# EAGLE design trial 3 (1) (EAGLE 6.5.0)
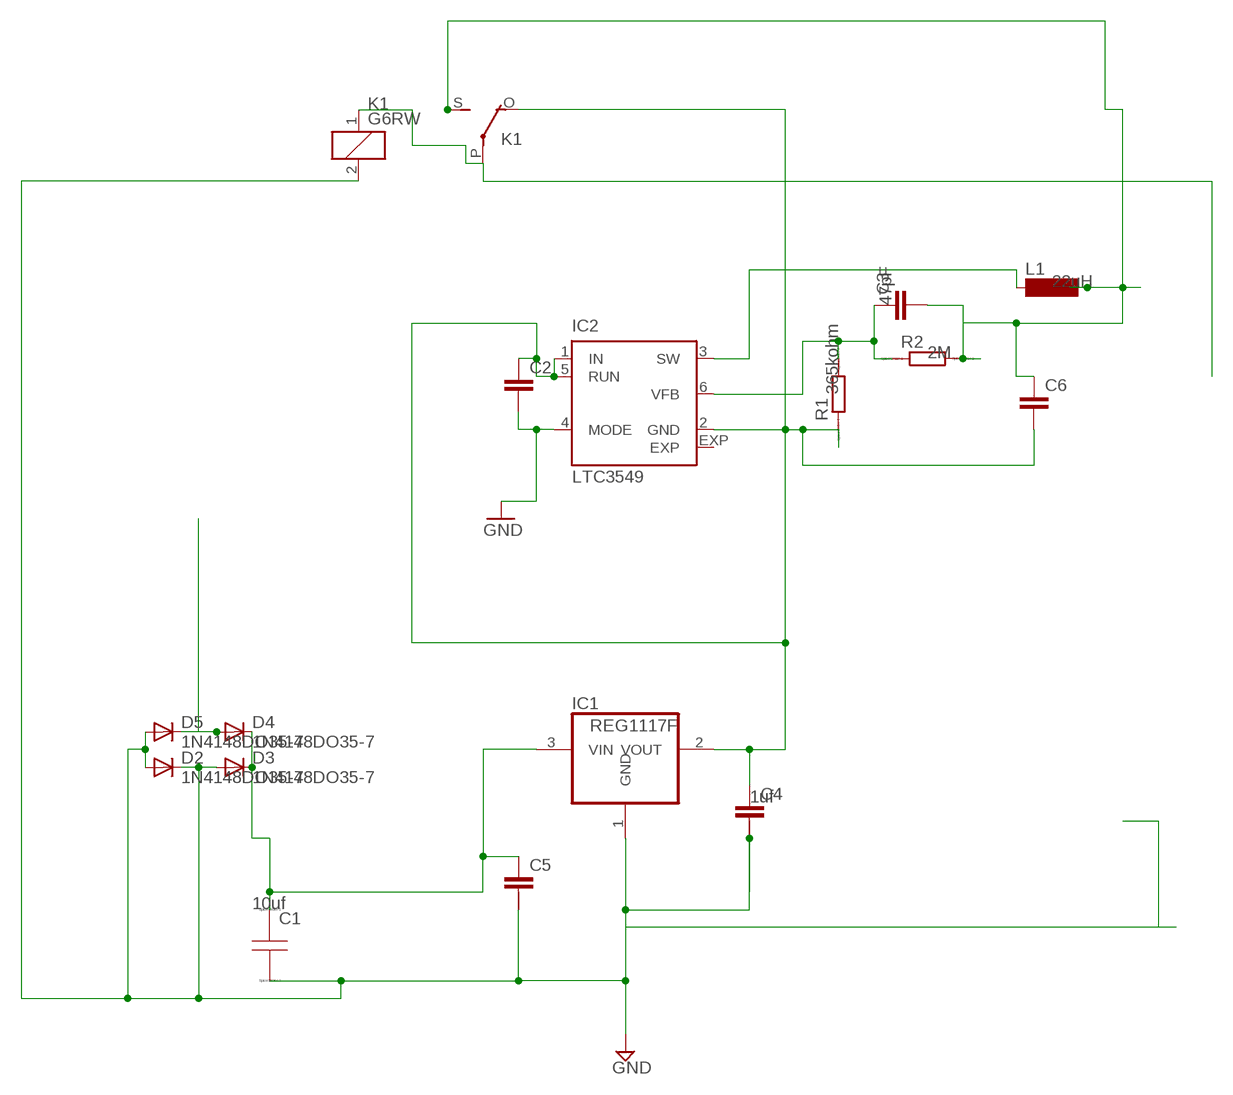
[diagram p0: schematic, sheet 1]

## Parts
C1  CAP  [C0805]
C2  C2,5-3  [C2.5-3]
C3  C2.5/4  [C2.5-4]
C4  C-2.5-5/5  [C2.5/5-5]
C5  C-2.5-5/5  [C2.5/5-5]
C6  C2.5/4  [C2.5-4]
D2  1N4148DO35-7  [DO35-7]
D3  1N4148DO35-7  [DO35-7]
D4  1N4148DO35-7  [DO35-7]
D5  1N4148DO35-7  [DO35-7]
IC1  REG1117F  [DD-3]
IC2  LTC3549  [DFN6-2X3]
K1  G6RW  [G6RW]
L1  MS85  [MS85]
R1  R0207/10  [0207/10]
R2  R0207/10  [0207/10]

## Nets
GND: C1.2(B) C2.2 C4.2 C5.2 D2.A D2.C D3.A D5.A IC1.1(GND) IC2.4(MODE) K1.2
N$1: C1.1(A) C5.1 D3.C D4.C IC1.3(VIN)
N$2: C2.1 C4.1 C6.2 IC1.2(VOUT) IC2.1(IN) IC2.2(GND) IC2.5(RUN) K1.O(2:O)
N$3: K1.1
N$5: C3.2 C6.1 K1.S(2:S) L1.2 R2.2
N$7: D4.A D5.C
N$8: C3.1 IC2.6(VFB) R1.2 R2.1
N$13: IC2.3(SW) L1.1
Unconnected: C4.3 C5.3 IC2.EXP K1.P(2:P) R1.1

## Library data of the parts
C1 = sym:CAP: Capacitor; C1: 10uf
C2 = capacitor-wima:C: CAPACITOR naming: grid - package width; C2: 1uf
C3 = capacitor-wima:C: CAPACITOR naming: grid - package width; C3: 47pF
C4 = capacitor-wima:C-: CAPACITOR for alternative placement naming: default grid - extended grid/package width; C4: 1uf
C5 = capacitor-wima:C-: CAPACITOR for alternative placement naming: default grid - extended grid/package width; C5: 1uf
C6 = capacitor-wima:C: CAPACITOR naming: grid - package width; C6: 4.7uF
D2-D5 = diode:1N4148: DIODE high speed (Philips)
IC1 = burr-brown:REG1117: 800mA and 1A Low Dropout (LDO) Positive Regulator 1.8V, 2.5V, 2.85V, 3.3V, 5V, and Adj; MF: TEXAS INSTRUMENTS; MPN: REG1117FAKTTT; OC_FARNELL: 1296120; OC_NEWARK: 87H2562
IC2 = linear-technology:LTC3549: 250mA Low VIN Buck Source: http://www.linear.com/pc/downloadDocument.do?navId=H0,C1,C1003,C1042,C1032,C1063,P26952,D16357; MPN: LTC3549EDCB#TRMPBF; OC_FARNELL: 1715241; OC_NEWARK: 56M8010
K1 = relay:G6RW: RELAY 1 x switch, Omron; OC_FARNELL: unknown; OC_NEWARK: unknown
L1 = inductor-neosid:MS85: INDUCTOR SMD power inductor; MF: 22uH; OC_FARNELL: unknown; OC_NEWARK: unknown
R1 = eagle-ltspice:R: RESISTOR, European symbol; SPICEMODEL: 365kohm; SPICEPREFIX: R
R2 = eagle-ltspice:R: RESISTOR, European symbol; SPICEMODEL: 2M; SPICEPREFIX: R

## Net classes
0 default: width 0.178 mm, drill 0.203 mm, clearance 0.025 mm

## Board
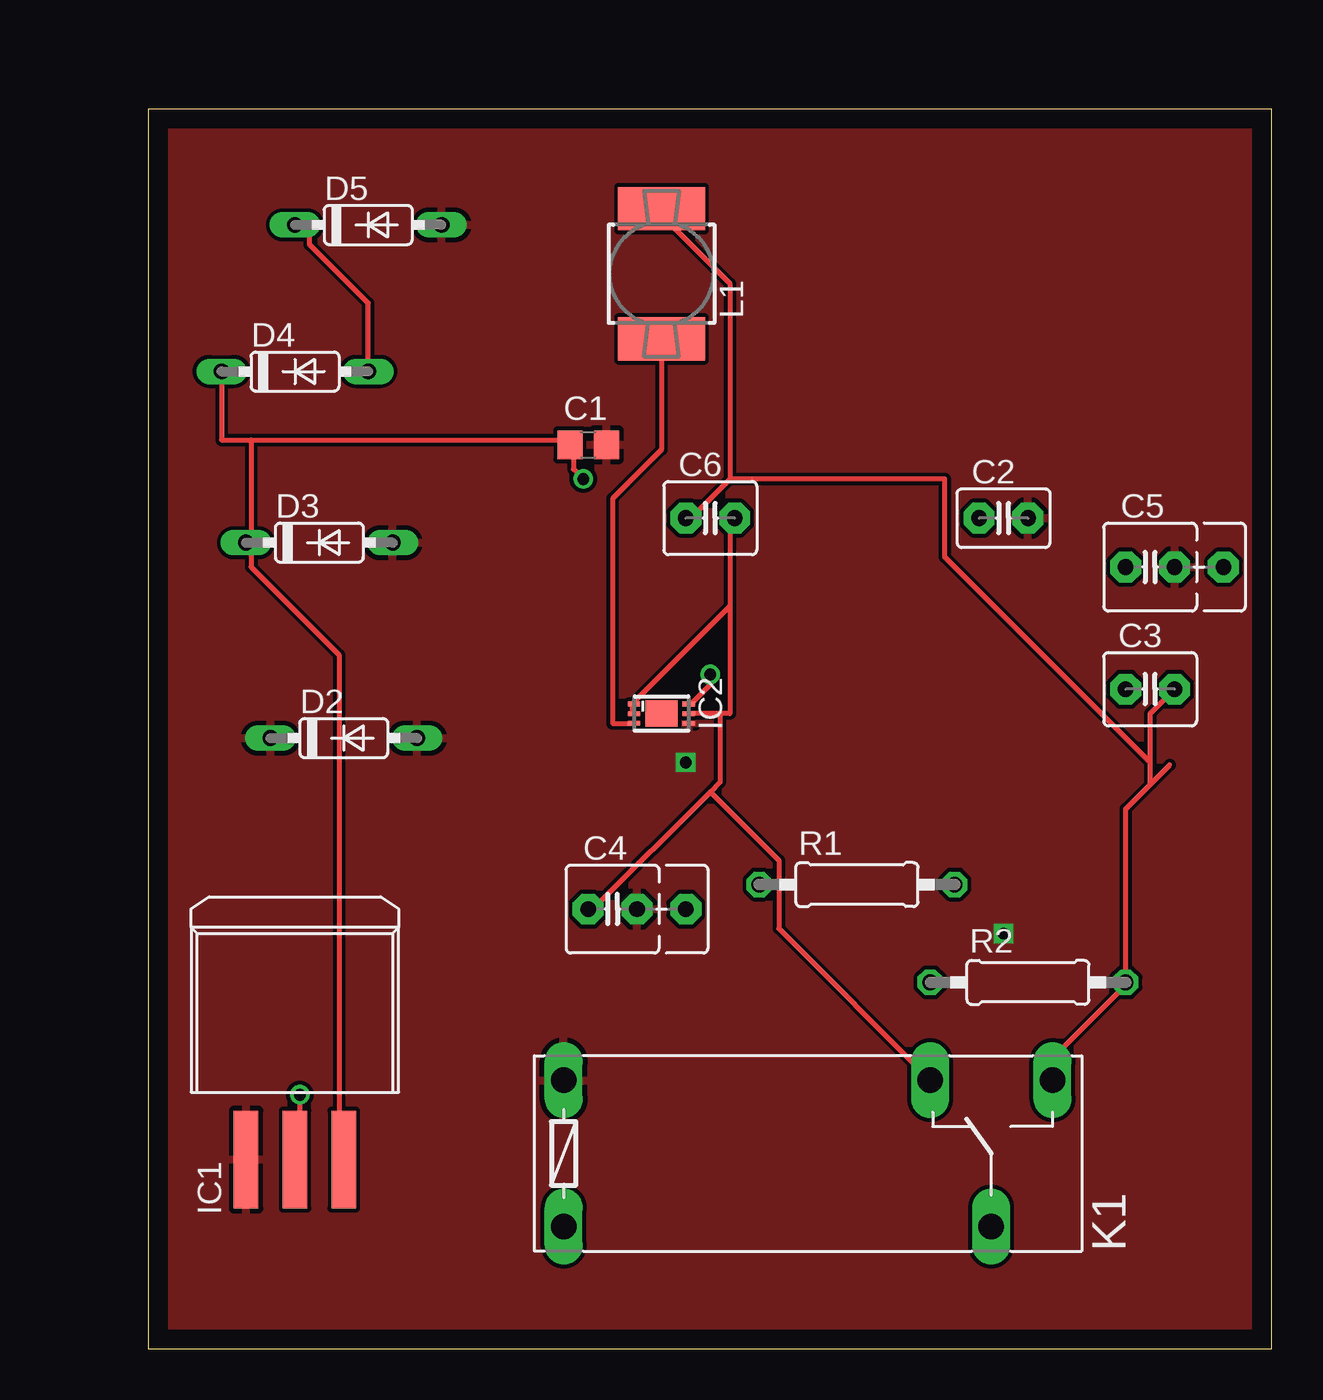
[diagram p1: board, top side]
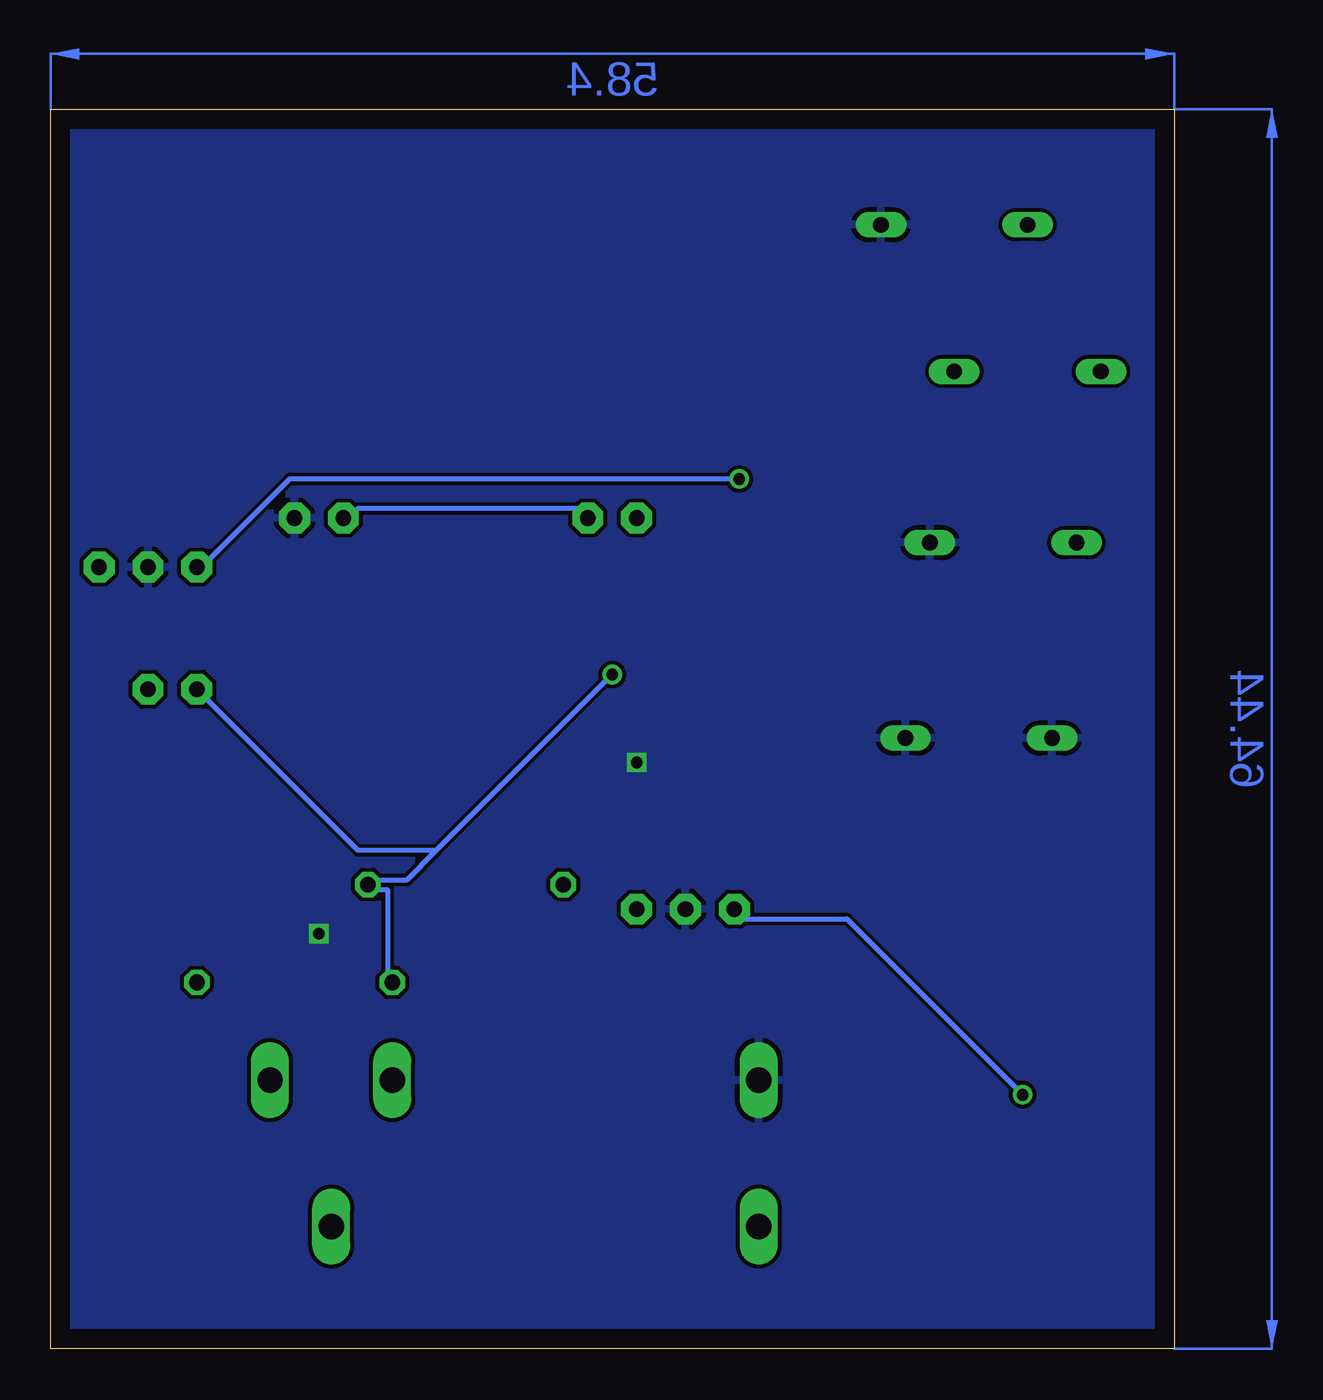
[diagram p2: board, bottom side, seen from below]

Size 58.4 x 64.44 mm. Coordinates in mm from the lower left corner, seen from the top.
Outline: 0,0 58.4,0 58.4,64.44 0,64.44 0,0
Copper layers (1*16): Top 0.035mm / dielectric 1.5mm / Bottom 0.035mm
Design rules "default": minimum track width 10mil, minimum drill 24mil, track to track 8mil, track to pad 8mil, pad to pad 8mil, via to via 8mil, smd to smd 8mil, copper to edge 40mil, drill to drill 8mil, minimum pad ring 10mil, minimum via ring 8mil, stop-mask expansion 4mil, vias tented up to drill 0mil, thermal gap 10mil

### Footprints (pad centres in the part's own frame; a part is rotated, then mirrored left to right if it is on the bottom)
C0805 = smd 1.3 x 1.5: 1 -0.95,0; 2 0.95,0
C2.5-3 = drill 0.813 pad 1.6 octagon: 1 -1.27,0; 2 1.27,0
C2.5-4 = drill 0.813 pad 1.6 octagon: 1 -1.27,0; 2 1.27,0
C2.5/5-5 = drill 0.813 pad 1.6 octagon: 1 -1.27,0; 2 1.27,0; 3 3.81,0
DO35-7 = drill 0.813 long: A 3.81,0; C -3.81,0
DD-3 = smd 1.27 x 5.08: 1 -2.54,-7.938; 2 0,-7.938; 3 2.54,-7.938
DFN6-2X3 = smd 0.25 x 0.7: 1 -0.5,-1.425; 2 0,-1.425; 3 0.5,-1.425; 4 0.5,1.425; 5 0,1.425; 6 -0.5,1.425 | smd 1.35 x 1.65: EXP 0,0
G6RW = drill 1.321 long: 1 -12.7,-3.81; 2 -12.7,3.81; O 6.35,3.81; P 9.525,-3.81; S 12.7,3.81
MS85 = smd 4.5 x 2.25: 1 0,-3.383; 2 0,3.383
0207/10 = drill 0.813 octagon: 1 -5.08,0; 2 5.08,0

### Placement (x,y rotation side)
C1  22.86,46.99 0 top
C2  44.45,43.18 0 top
C3  52.07,34.29 0 top
C4  24.13,22.86 0 top
C5  52.07,40.64 0 top
C6  29.21,43.18 0 top
D2  10.16,31.75 0 top
D3  8.89,41.91 0 top
D4  7.62,50.8 0 top
D5  11.43,58.42 0 top
IC1  7.62,17.78 0 top
IC2  26.67,33.02 270 top
K1  34.29,10.16 0 top
L1  26.67,55.88 0 top
R1  36.83,24.13 0 top
R2  45.72,19.05 0 top

### Tracks (layer width: path | path; a pad name or v marks a point on that pad's centre or on a via)
GND  (via drill 0.6)
  other vias: 27.94,30.48 44.45,21.59
  pour Top: -5.08,69.85 64.77,69.85 64.77,-3.81 -5.08,-3.81
  pour Bottom: -1.27,66.04 59.69,66.04 59.69,-1.27 -1.27,-1.27
N$1  (via drill 0.61)
  Top 0.254: 5.33,47.24 3.81,47.24 D4.C | 5.33,47.24 21.59,47.24 C1.1 22.1,46.74 22.1,45.72 v22.61,45.21 | 5.33,47.24 5.33,42.16 D3.C 5.33,41.66 5.33,40.64 9.91,36.07 9.91,10.16 IC1.3
  Bottom 0.254: v22.61,45.21 45.97,45.21 50.55,40.64 C5.1
N$2  (via drill 0.61)
  Top 0.254: 25.15,33.53 25.15,33.02 IC2.2 | 29.72,33.02 30.23,33.02 30.23,38.61 | 29.72,33.02 IC2.5 | 30.23,38.61 30.23,43.18 C6.2 | 30.23,38.61 25.15,33.53 | 25.15,33.53 IC2.1 | 29.21,28.96 29.72,29.46 29.72,33.02 | 29.21,28.96 23.11,22.86 C4.1 | K1.O 32.77,21.84 32.77,25.4 29.21,28.96 | v7.87,13.21 7.87,10.16 IC1.2
  Bottom 0.254: C2.1 42.93,43.18 42.42,43.69 30.73,43.69 30.23,43.18 C6.2 | v7.87,13.21 17.02,22.35 22.61,22.35 23.11,22.86 C4.1
N$5
  Top 0.254: 46.99,15.11 47.05,15.18 | 47.05,15.18 50.8,18.92 R2.2 50.8,28.07 52.13,29.4 | 52.13,29.4 53.09,30.35 | 30.23,45.21 28.19,43.18 C6.1 | 30.23,45.21 30.23,55.37 26.67,58.93 L1.2 | C3.2 52.07,33.02 52.07,30.48 | 52.07,30.48 52.07,29.46 52.13,29.4 | K1.S 46.99,15.24 47.05,15.18 | 30.23,45.21 41.4,45.21 41.4,41.15 52.07,30.48
N$7
  Top 0.254: D4.A 11.43,54.36 8.38,57.4 8.38,57.91 7.87,58.42 D5.C
N$8  (via drill 0.61)
  Top 0.254: v29.21,35.05 29.21,34.54 28.19,33.53 IC2.6
  Bottom 0.254: 38.35,25.91 39.88,24.38 41.91,24.38 R1.2 41.91,23.88 40.89,23.88 40.89,19.3 R2.1 | 38.35,25.91 v29.21,35.05 | C3.1 42.42,25.91 38.35,25.91
N$13
  Top 0.254: L1.1 26.67,46.74 24.13,44.2 24.13,32.51 25.15,32.51 IC2.3
(copper drawn outside any net)
  shapes: Bottom area x2